# Altium schematic sheet SKC_ErrrorDisplay.SchDoc: SKC Error Display
size A4; Author: eldar6776@hotmail.com; DrawnBy: Eldar Dedić; Organization: PROVEN d.o.o.; Address1: Adema Buće 102; Address2: 71000 Sarajevo; Address3: Federacija BiH; Address4: Bosna i Hercegovina; DocumentNumber: DE211213; Revision: 001; SheetNumber: 14; SheetTotal: 15
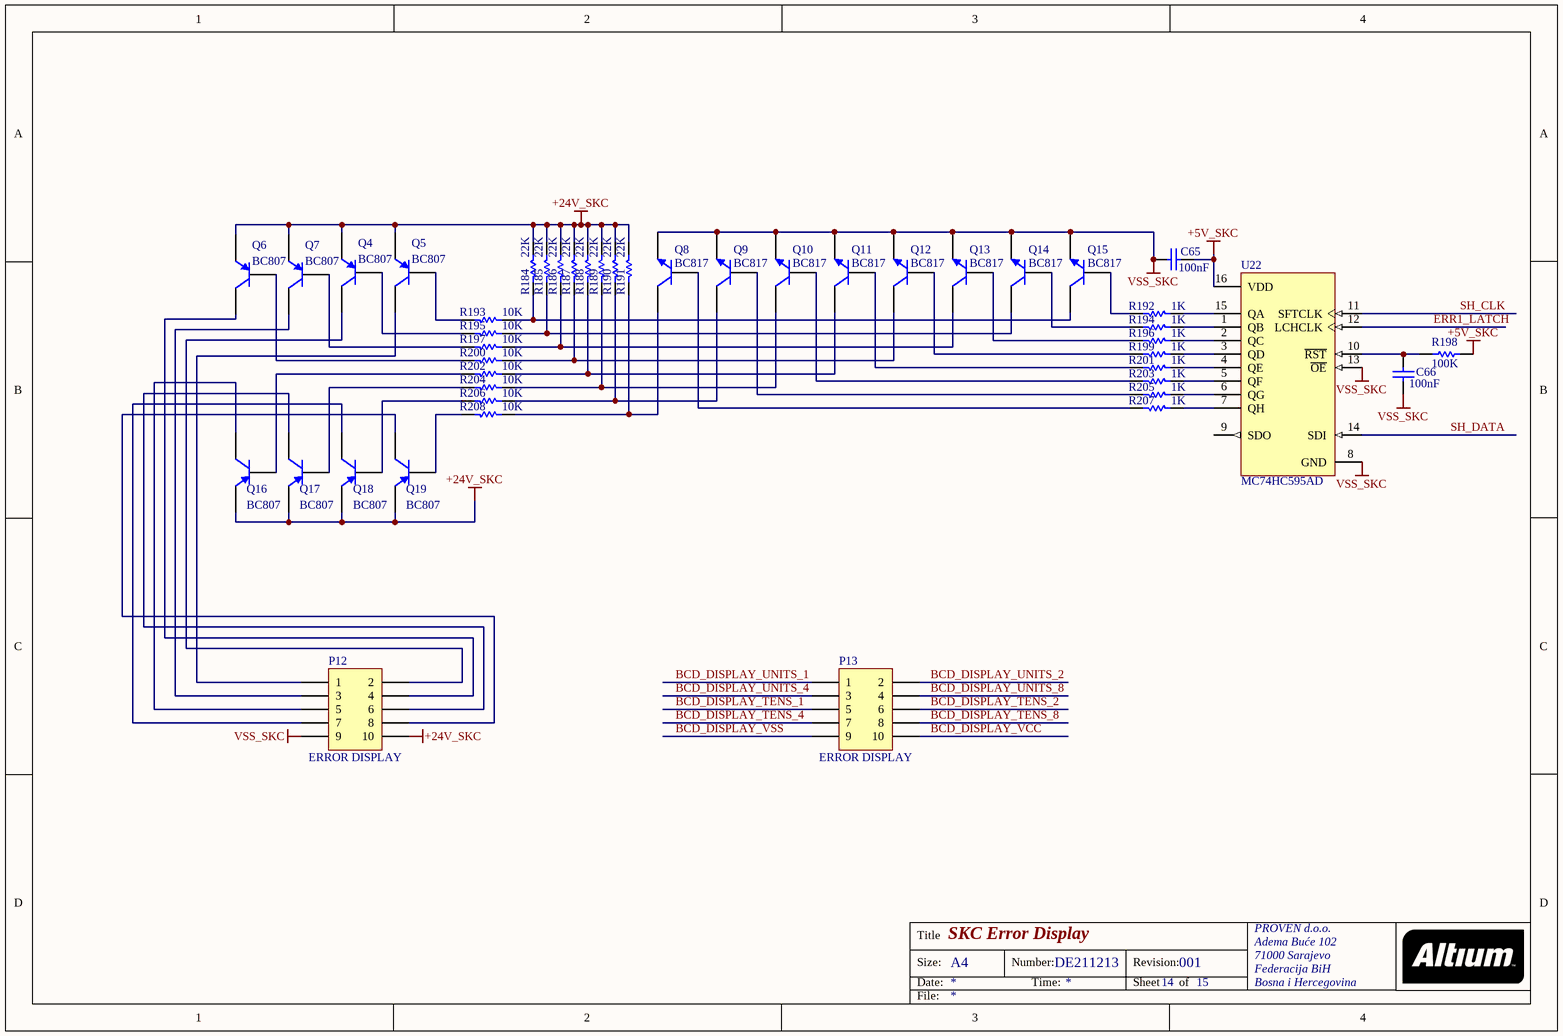
[diagram p0: SKC_ErrrorDisplay.SchDoc]

## Parts
C65  value 100nF  [1206]
C66  value 100nF  [1206]
P12  ERROR DISPLAY  [HDR2X5]
P13  ERROR DISPLAY  [HDR2X5]
Q4  BC807  [SOT23_N]
Q5  BC807  [SOT23_N]
Q6  BC807  [SOT23_N]
Q7  BC807  [SOT23_N]
Q8  BC817  [SOT23_N]
Q9  BC817  [SOT23_N]
Q10  BC817  [SOT23_N]
Q11  BC817  [SOT23_N]
Q12  BC817  [SOT23_N]
Q13  BC817  [SOT23_N]
Q14  BC817  [SOT23_N]
Q15  BC817  [SOT23_N]
Q16  BC807  [SOT23_N]
Q17  BC807  [SOT23_N]
Q18  BC807  [SOT23_N]
Q19  BC807  [SOT23_N]
R184  22K  [ERA-0805]
R185  22K  [ERA-0805]
R186  22K  [ERA-0805]
R187  22K  [ERA-0805]
R188  22K  [ERA-0805]
R189  22K  [ERA-0805]
R190  22K  [ERA-0805]
R191  22K  [ERA-0805]
R192  1K  [ERA-0805]
R193  10K  [ERA-0805]
R194  1K  [ERA-0805]
R195  10K  [ERA-0805]
R196  1K  [ERA-0805]
R197  10K  [ERA-0805]
R198  100K  [ERA-0603]
R199  1K  [ERA-0805]
R200  10K  [ERA-0805]
R201  1K  [ERA-0805]
R202  10K  [ERA-0805]
R203  1K  [ERA-0805]
R204  10K  [ERA-0805]
R205  1K  [ERA-0805]
R206  10K  [ERA-0805]
R207  1K  [ERA-0805]
R208  10K  [ERA-0805]
U22  MC74HC595AD  [751B-05_N]

## Nets
+5V_SKC: C65.2 R198.2 U22.16(VDD)
+24V_SKC: P12.10 Q4.2(E) Q5.2(E) Q6.2(E) Q7.2(E) Q16.2(E) Q17.2(E) Q18.2(E) Q19.2(E) R184.2 R185.2 R186.2 R187.2 R188.2 R189.2 R190.2 R191.2
VSS_SKC: C65.1 C66.1 P12.9 Q8.2(E) Q9.2(E) Q10.2(E) Q11.2(E) Q12.2(E) Q13.2(E) Q14.2(E) Q15.2(E) U22.8(GND) U22.13(~{OE})
BCD_DISPLAY_TENS_1: P13.5
BCD_DISPLAY_TENS_2: P13.6
BCD_DISPLAY_TENS_4: P13.7
BCD_DISPLAY_TENS_8: P13.8
BCD_DISPLAY_UNITS_1: P13.1
BCD_DISPLAY_UNITS_2: P13.2
BCD_DISPLAY_UNITS_4: P13.3
BCD_DISPLAY_UNITS_8: P13.4
BCD_DISPLAY_VCC: P13.10
BCD_DISPLAY_VSS: P13.9
ERR1_LATCH: U22.12(LCHCLK)
SH_CLK: U22.11(SFTCLK)
SH_DATA: U22.14(SDI)
NetC66_2: C66.2 R198.1 U22.10(~{RST})
NetP12_1: P12.1 Q5.3(C)
NetP12_2: P12.2 Q4.3(C)
NetP12_3: P12.3 Q7.3(C)
NetP12_4: P12.4 Q6.3(C)
NetP12_5: P12.5 Q16.3(C)
NetP12_6: P12.6 Q17.3(C)
NetP12_7: P12.7 Q18.3(C)
NetP12_8: P12.8 Q19.3(C)
NetQ4_1: Q4.1(B) R195.1
NetQ5_1: Q5.1(B) R193.1
NetQ6_1: Q6.1(B) R200.1
NetQ7_1: Q7.1(B) R197.1
NetQ8_1: Q8.1(B) R207.1
NetQ8_3: Q8.3(C) R191.1 R208.2
NetQ9_1: Q9.1(B) R205.1
NetQ9_3: Q9.3(C) R190.1 R206.2
NetQ10_1: Q10.1(B) R203.1
NetQ10_3: Q10.3(C) R189.1 R204.2
NetQ11_1: Q11.1(B) R201.1
NetQ11_3: Q11.3(C) R188.1 R202.2
NetQ12_1: Q12.1(B) R199.1
NetQ12_3: Q12.3(C) R187.1 R200.2
NetQ13_1: Q13.1(B) R196.1
NetQ13_3: Q13.3(C) R186.1 R197.2
NetQ14_1: Q14.1(B) R194.1
NetQ14_3: Q14.3(C) R185.1 R195.2
NetQ15_1: Q15.1(B) R192.1
NetQ15_3: Q15.3(C) R184.1 R193.2
NetQ16_1: Q16.1(B) R202.1
NetQ17_1: Q17.1(B) R204.1
NetQ18_1: Q18.1(B) R206.1
NetQ19_1: Q19.1(B) R208.1
NetR192_2: R192.2 U22.15(QA)
NetR194_2: R194.2 U22.1(QB)
NetR196_2: R196.2 U22.2(QC)
NetR199_2: R199.2 U22.3(QD)
NetR201_2: R201.2 U22.4(QE)
NetR203_2: R203.2 U22.5(QF)
NetR205_2: R205.2 U22.6(QG)
NetR207_2: R207.2 U22.7(QH)

Not connected (* = marked no-connect by the designer): U22 9(SDO)

## Notes on the sheet
- Title
- Size:
- Date:
- A4
- Number:
- Time:
- Revision:
- Sheet
- of
- File:

## Library data of the parts
C65 C66 = C1206: Ceramic Chip Capacitor - Standard; Published: 17-Jul-2002; LatestRevisionDate: 19-Mar-2004; LatestRevisionNote: Silkscreen size reduced.; DatasheetDocument: Mar-2001; PackageDocument: Mar-2001; PackageReference: 1206; Publisher: Altium Limited; Code_JEITA: 1206; Code_IPC: 3216 [1206]; ComponentLink1Description: Manufacturer Link; ComponentLink1URL: http://www.kemet.com/; ComponentLink2Description: Datasheet; ComponentLink2URL: http://www.kemet.com/kemet/web/homepage/kechome.nsf/vapubfilesname/F3102TA.pdf/$file/F3102TA.pdf
P12 P13 = Header 5X2: Header, 5-Pin, Dual row; LatestRevisionDate: 17-Jul-2002; LatestRevisionNote: Re-released for DXP Platform.; Publisher: Altium Limited
Q4-Q7 Q16-Q19 = BC807: PNP General-purpose Transistor; Published: 17-Sep-2003; LatestRevisionDate: 12-Dec-2006; LatestRevisionNote: IPC-7351 Footprint Added.; DatasheetVersion: 8-Apr-1999; PackageVersion: May-1999; PackageReference: SOT23; Publisher: Altium Limited; PackageDescription: 3-Pin SOT-23 Package 0.95 mm Pitch, 2.3 mm Lead Span; ComponentLink1Description: Manufacturer Link; ComponentLink1URL: http://www.semiconductors.philips.com/; ComponentLink2Description: Datasheet; ComponentLink2URL: http://www.semiconductors.philips.com/acrobat/datasheets/BC807_BC807W_BC327_5.pdf
Q8-Q15 = BC817-16: NPN General-purpose Transistor; Published: 17-Sep-2003; LatestRevisionDate: 12-Dec-2006; LatestRevisionNote: IPC-7351 Footprint Added.; DatasheetVersion: Jun-1999; PackageVersion: May-1999; PackageReference: SOT23; Publisher: Altium Limited; PackageDescription: 3-Pin SOT-23 Package 0.95 mm Pitch, 2.3 mm Lead Span; ComponentLink1Description: Manufacturer Link; ComponentLink1URL: http://www.semiconductors.philips.com/; ComponentLink2Description: Datasheet; ComponentLink2URL: http://www.semiconductors.philips.com/acrobat/datasheets/BC817_BC817W_BC337_5.pdf
R184-R197 R199-R208 = ERA6Y: Rectangular Thick Film Chip Resistor, 10 Ohm to 1M Ohm Range, 0.1% and 0.5% Tolerance, 0805 Size, 0.1 W; Note: If flow soldering, adjust pad width of PCB Footprint to 0.7 - 0.8 times the width of the resistor.; Published: 17-Dec-2003; LatestRevisionDate: 19-Mar-2004; LatestRevisionNote: Silkscreen size reduced.; PackageDocument: Mar-2003; PackageReference: ERA-0805; Publisher: Altium Limited; Code_IPC: 2012 [0805]; ComponentLink1Description: Manufacturer Link; ComponentLink1URL: http://www.panasonic.com/industrial/components/resistive_products.htm; ComponentLink2Description: Datasheet; ComponentLink2URL: http://www.panasonic.com/industrial/components/pdf/AOA0000CE8.pdf
R198 = ERA3Y: Rectangular Thick Film Chip Resistor, 10 Ohm to 330k Ohm Range, 0.1% and 0.5% Tolerance, 0603 Size, 0.063 W; Note: If flow soldering, adjust pad width of PCB Footprint to 0.7 - 0.8 times the width of the resistor.; Published: 17-Dec-2003; LatestRevisionDate: 19-Mar-2004; LatestRevisionNote: Silkscreen size reduced.; PackageDocument: Mar-2003; PackageReference: ERA-0603; Publisher: Altium Limited; Code_IPC: 1608 [0603]; ComponentLink1Description: Manufacturer Link; ComponentLink1URL: http://www.panasonic.com/industrial/components/resistive_products.htm; ComponentLink2Description: Datasheet; ComponentLink2URL: http://www.panasonic.com/industrial/components/pdf/AOA0000CE8.pdf
U22 = MC74HC595AD: 8-Bit Serial-Input/Serial or Prallel-Output Shift Register with Latched 3-State Outputs; Published: 15-Apr-2002; LatestRevisionDate: 13-Apr-2006; LatestRevisionNote: IPC-7351 Footprint Added.; DatasheetVersion: Mar-2000; PackageVersion: Oct-1999; PackageReference: 751B-05; Publisher: Altium Limited; PackageDescription: 16-Pin Small Outline Integrated Circuit 1.27 mm Pitch; Code_JEDEC: MS-012-AC; Code_IPC: SOIC127P600-16; ComponentLink1Description: Manufacturer Link; ComponentLink1URL: http://www.onsemi.com/; ComponentLink2Description: Datasheet; ComponentLink2URL: http://www.onsemi.com/pub/Collateral/MC74HC595A-D.PDF